# Altium schematic sheet 原理图.SchDoc
size A4
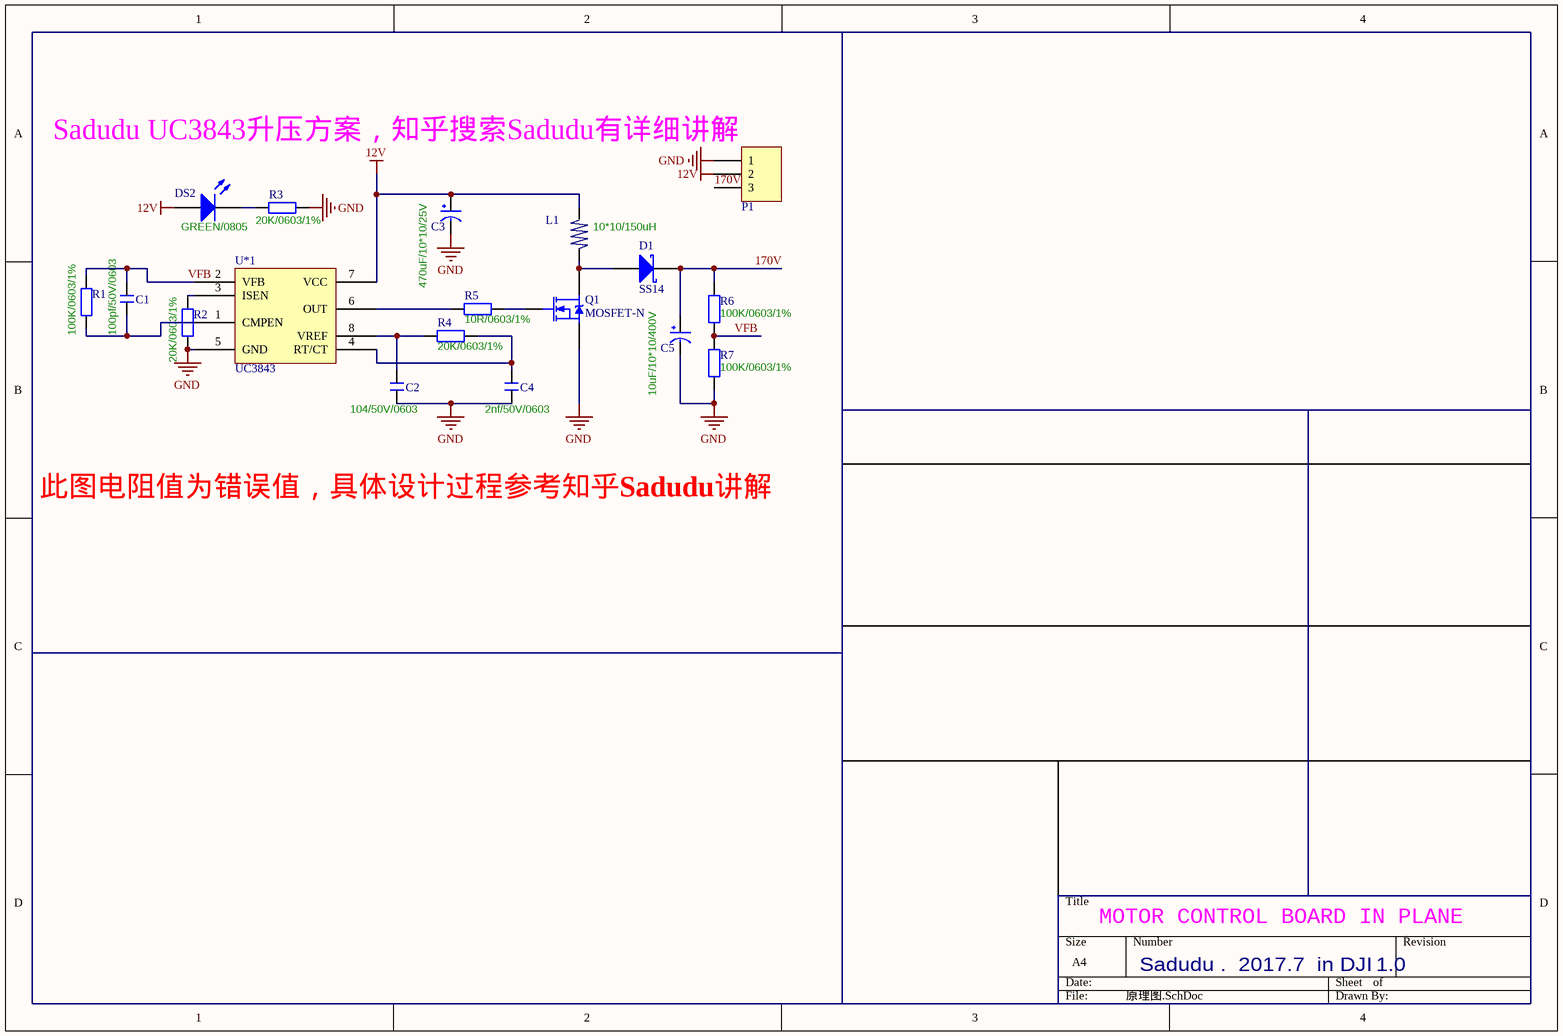
[diagram p0: 原理图.SchDoc]

## Parts
C1  100pf/50V/0603  [C-RAD-0603]
C2  104/50V/0603  [C-RAD-0603]
C3  470uF/10*10/25V  [C-RAD-0805]
C4  2nf/50V/0603  [C-RAD-0603]
C5  10uF/10*10/400V  [5032]
D1  Type: SS14  [DIODE-SMA]  (hidden comment: D-Schottky)
DS2  GREEN/0805  [SMDLED]
L1  10*10/150uH  [L1010]
P1  Header 3  [HEADER-3]  (value not drawn)
Q1  MOSFET-N  [D-PAK]
R1  value 100K/0603/1%  [0603-1]  (hidden comment: Res1)
R2  value 20K/0603/1%  [0603-1]  (hidden comment: Res1)
R3  value 20K/0603/1%  [0603-1]  (hidden comment: Res1)
R4  value 20K/0603/1%  [0603-1]  (hidden comment: Res1)
R5  value 10R/0603/1%  [0603-1]  (hidden comment: Res1)
R6  value 100K/0603/1%  [0603-1]  (hidden comment: Res1)
R7  value 100K/0603/1%  [0603-1]  (hidden comment: Res1)
U*1  UC3843  [SOP-8]

## Nets
12V: C3.1(VCC) DS2.1(A) L1.1 P1.2 U*1.7(VCC)
GND: C2.1 C3.2(GND) C4.1 C5.2(GND) P1.1 Q1.S R2.1 R3.1 R7.1 U*1.5(GND)
170V: C5.1(VCC) D1.2(K) P1.3 R6.2
VFB: C1.1 R1.1 R6.1 R7.2 U*1.2(VFB)
NetC1_2: C1.2 R1.2 U*1.1(CMPEN)
NetC2_2: C2.2 R4.1 U*1.8(VREF)
NetC4_2: C4.2 R4.2 U*1.4(RT/CT)
NetD1_1: D1.1(A) L1.2 Q1.D
NetDS2_2: DS2.2(K) R3.2
NetQ1_G: Q1.G R5.2
NetR2_2: R2.2 U*1.3(ISEN)
NetR5_1: R5.1 U*1.6(OUT)

## Notes on the sheet
- Sadudu UC3843升压方案，知乎搜索Sadudu有详细讲解
- 此图电阻值为错误值，具体设计过程参考知乎Sadudu讲解
- MOTOR CONTROL BOARD IN PLANE
- Sadudu .  2017.7  in DJI
- 1.0

## Library data of the parts
C1 C2 C4 = C_1
C3 C5 = CAP
D1 = D-Schottky: 肖特基二极管; Published: 8-Jun-2000; LatestRevisionDate: 17-Jul-2002; LatestRevisionNote: Re-released for DXP Platform.; PackageReference: SMB; Publisher: Altium Limited; Code_JEDEC: DO-214-AA
DS2 = LED2: Typical RED, GREEN, YELLOW, AMBER GaAs LED; Published: 8-Jun-2000; LatestRevisionDate: 17-Jul-2002; LatestRevisionNote: Re-released for DXP Platform.; PackageDocument: Feb-2002; PackageReference: 3.2X1.6X1.1; Publisher: Altium Limited
L1 = L
P1 = Header 3: 接插件; LatestRevisionDate: 17-Jul-2002; LatestRevisionNote: Re-released for DXP Platform.; Publisher: Altium Limited
Q1 = MOSFET-N: N-Channel MOSFET; pin to pad: D>2 G>1 S>3; PackageDocument: 1995/1996; Published: 8-Jun-2000; LatestRevisionDate: 17-Jul-2002; LatestRevisionNote: Re-released for DXP Platform.; PackageReference: E3; Publisher: Altium Limited
R1-R7 = Res1: 贴片电阻; Published: 8-Jun-2000; LatestRevisionDate: 17-Jul-2002; LatestRevisionNote: Re-released for DXP Platform.; PackageReference: AXIAL-0.4; Publisher: Altium Limited